# Altium project StandaloneDevice.PrjPcb
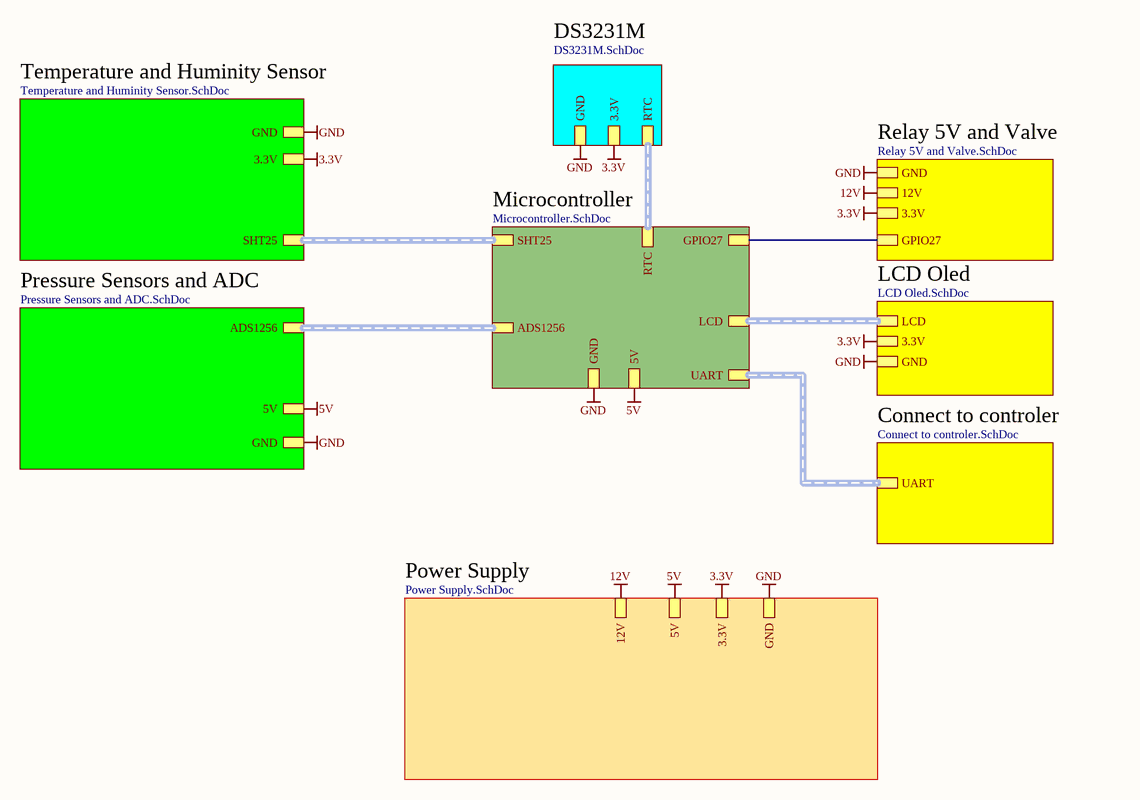
[diagram p0: StandaloneDevice.SchDoc]
9 sheets, 13 parts. Net scope: hierarchical (ports join the sheet entries above them; power ports are global).
Board file: StandaloneDevice.PcbDoc
Sheets:
  StandaloneDevice.SchDoc
    Pressure Sensors and ADC = Pressure Sensors and ADC.SchDoc
    Temperature and Huminity Sensor = Temperature and Huminity Sensor.SchDoc
    Microcontroller = Microcontroller.SchDoc
    Power Supply = Power Supply.SchDoc
    Relay 5V and Valve = Relay 5V and Valve.SchDoc
    LCD Oled = LCD Oled.SchDoc
    DS3231M = DS3231M.SchDoc
    Connect to controler = Connect to controler.SchDoc

## Sheet StandaloneDevice.SchDoc
size A4; SheetNumber: 1; SheetTotal: 9

### Sub-sheets
Connect to controler = Connect to controler.SchDoc: UART (harness UART)
DS3231M = DS3231M.SchDoc: RTC (harness RTC), 3.3V, GND
LCD Oled = LCD Oled.SchDoc: LCD (harness LCD), 3.3V, GND
Microcontroller = Microcontroller.SchDoc: GPIO27, ADS1256 (harness ADS1256), SHT25 (harness SHT25), LCD (harness LCD), RTC (harness RTC), UART (harness UART), GND, 5V
Power Supply = Power Supply.SchDoc: 12V, 5V, 3.3V, GND
Pressure Sensors and ADC = Pressure Sensors and ADC.SchDoc: ADS1256 (harness ADS1256), 5V, GND
Relay 5V and Valve = Relay 5V and Valve.SchDoc: GPIO27, GND, 12V, 3.3V
Temperature and Huminity Sensor = Temperature and Huminity Sensor.SchDoc: SHT25 (harness SHT25), GND, 3.3V

### Nets
3.3V: sheet Temperature and Huminity Sensor/3.3V, sheet Power Supply/3.3V, sheet Relay 5V and Valve/3.3V, sheet LCD Oled/3.3V, sheet DS3231M/3.3V
5V: sheet Pressure Sensors and ADC/5V, sheet Microcontroller/5V, sheet Power Supply/5V
12V: sheet Power Supply/12V, sheet Relay 5V and Valve/12V
GND: sheet Pressure Sensors and ADC/GND, sheet Temperature and Huminity Sensor/GND, sheet Microcontroller/GND, sheet Power Supply/GND, sheet Relay 5V and Valve/GND, sheet LCD Oled/GND, sheet DS3231M/GND
GPIO27: sheet Microcontroller/GPIO27, sheet Relay 5V and Valve/GPIO27

### Buses and harness runs
harness sheet Connect to controler/UART = sheet Microcontroller/UART
harness sheet DS3231M/RTC = sheet Microcontroller/RTC
harness sheet LCD Oled/LCD = sheet Microcontroller/LCD
harness sheet Microcontroller/ADS1256 = sheet Pressure Sensors and ADC/ADS1256
harness sheet Microcontroller/SHT25 = sheet Temperature and Huminity Sensor/SHT25

## Sheet Pressure Sensors and ADC.SchDoc
size A4; SheetNumber: 2; SheetTotal: 9
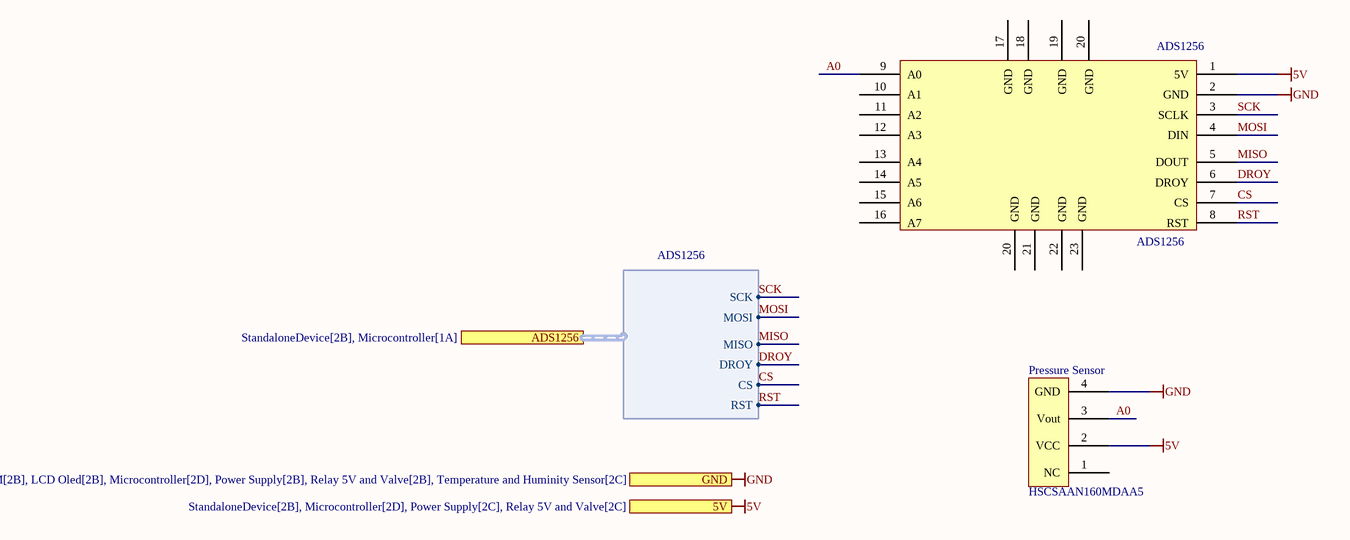
[diagram p1: Pressure Sensors and ADC.SchDoc]

### Parts
ADS1256  ADS1256  [ADS1256]
Pressure_Sensor  HSCSAAN160MDAA5  [HSCSAAN160MDAA5]

### Ports
5V (see StandaloneDevice[2B], Microcontroller[2D], Power Supply[2C], Relay 5V and Valve[2C]), ADS1256 (harness ADS1256, see StandaloneDevice[2B], Microcontroller[1A]), GND (see StandaloneDevice[2C], DS3231M[2B], LCD Oled[2B], Microcontroller[2D], Power Supply[2B], Relay 5V and Valve[2B], Temperature and Huminity Sensor[2C])

### Harnesses
ADS1256: SCK, MOSI, MISO, DROY, CS, RST

### Nets
5V: ADS1256.1(5V) Pressure_Sensor.2(VCC) ; port 5V
GND: ADS1256.2(GND) Pressure_Sensor.4(GND) ; port GND
A0: ADS1256.9(A0) Pressure_Sensor.3(Vout)
CS: ADS1256.7(CS) ; port ADS1256.CS
DROY: ADS1256.6(DROY) ; port ADS1256.DROY
MISO: ADS1256.5(DOUT) ; port ADS1256.MISO
MOSI: ADS1256.4(DIN) ; port ADS1256.MOSI
RST: ADS1256.8(RST) ; port ADS1256.RST
SCK: ADS1256.3(SCLK) ; port ADS1256.SCK

Not connected (* = marked no-connect by the designer): ADS1256 10(A1) 11(A2) 12(A3) 13(A4) 14(A5) 15(A6) 16(A7) 17(GND) 18(GND) 19(GND) 20(GND) 21(GND) 22(GND) 23(GND); Pressure_Sensor 1(NC)

## Sheet Temperature and Huminity Sensor.SchDoc
size A4; SheetNumber: 3; SheetTotal: 9
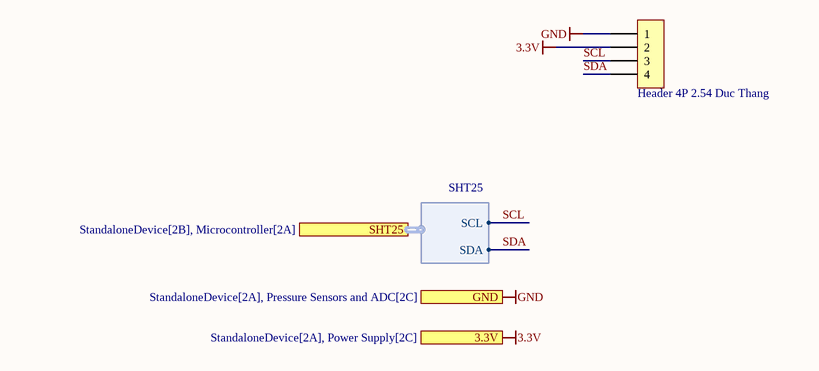
[diagram p2: Temperature and Huminity Sensor.SchDoc]

### Parts
SHT25  Header 4P 2.54 Duc Thang  [XH2.54M-4]

### Ports
3.3V (see StandaloneDevice[2A], Power Supply[2C]), GND (see StandaloneDevice[2A], Pressure Sensors and ADC[2C]), SHT25 (harness SHT25, see StandaloneDevice[2B], Microcontroller[2A])

### Harnesses
SHT25: SCL, SDA

### Nets
3.3V: SHT25.2 ; port 3.3V
GND: SHT25.1 ; port GND
SCL: SHT25.3 ; port SHT25.SCL
SDA: SHT25.4 ; port SHT25.SDA

### Library data of the parts
SHT25 = Header 4P 2.54 Duc Thang: Cắm; Ten_Linh_Kien: Header 4P XH2.54-4P Đực Thẳng; Don_Vi: Con; Ma_Hang: MH001285; Chung_Loai: Cắm

## Sheet Microcontroller.SchDoc
size A4; SheetNumber: 4; SheetTotal: 9
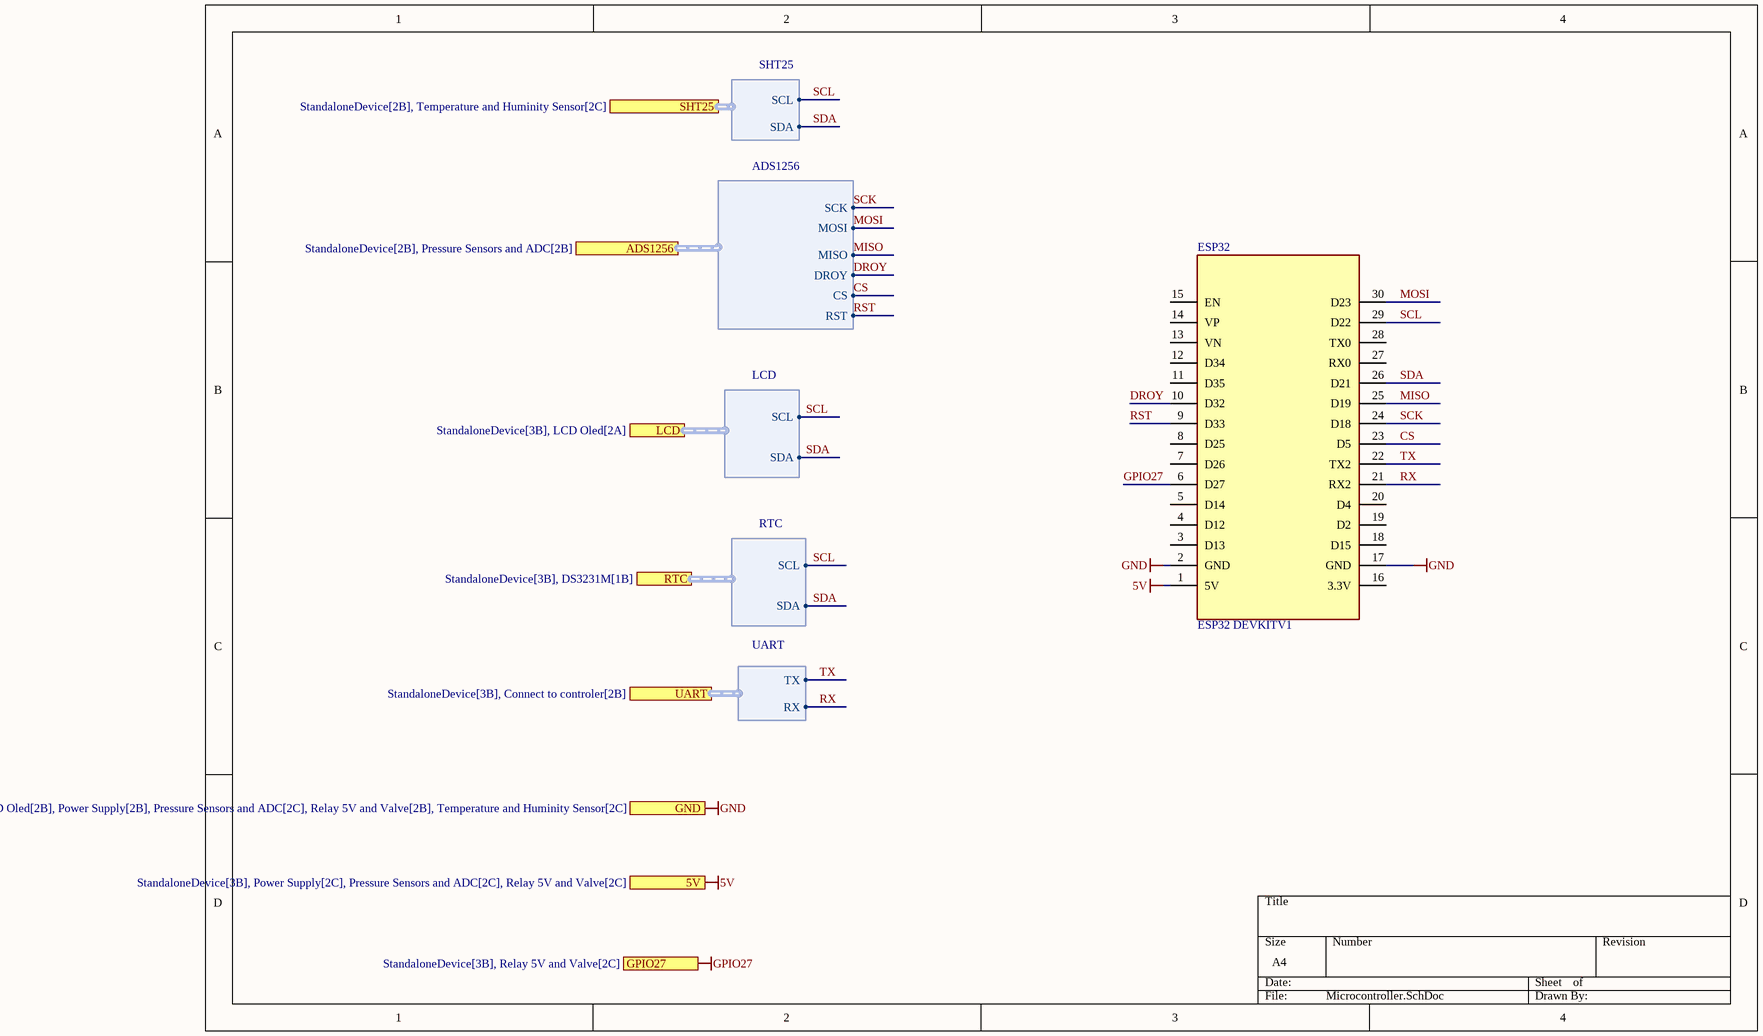
[diagram p3: Microcontroller.SchDoc]

### Parts
ESP32  ESP32 DEVKITV1  [ESP32 DEVKITV1]

### Ports
5V (see StandaloneDevice[3B], Power Supply[2C], Pressure Sensors and ADC[2C], Relay 5V and Valve[2C]), ADS1256 (harness ADS1256, see StandaloneDevice[2B], Pressure Sensors and ADC[2B]), GND (see StandaloneDevice[3B], DS3231M[2B], LCD Oled[2B], Power Supply[2B], Pressure Sensors and ADC[2C], Relay 5V and Valve[2B], Temperature and Huminity Sensor[2C]), GPIO27 (see StandaloneDevice[3B], Relay 5V and Valve[2C]), LCD (harness LCD, see StandaloneDevice[3B], LCD Oled[2A]), RTC (harness RTC, see StandaloneDevice[3B], DS3231M[1B]), SHT25 (harness SHT25, see StandaloneDevice[2B], Temperature and Huminity Sensor[2C]), UART (harness UART, see StandaloneDevice[3B], Connect to controler[2B])

### Harnesses
SHT25: SCL, SDA
ADS1256: SCK, MOSI, MISO, DROY, CS, RST
LCD: SCL, SDA
RTC: SCL, SDA
UART: TX, RX

### Nets
5V: ESP32.1(5V) ; port 5V
GND: ESP32.2(GND) ESP32.17(GND) ; port GND
GPIO27: ESP32.6(D27) ; port GPIO27
CS: ESP32.23(D5) ; port ADS1256.CS
DROY: ESP32.10(D32) ; port ADS1256.DROY
MISO: ESP32.25(D19) ; port ADS1256.MISO
MOSI: ESP32.30(D23) ; port ADS1256.MOSI
RST: ESP32.9(D33) ; port ADS1256.RST
RX: ESP32.21(RX2) ; port UART.RX
SCK: ESP32.24(D18) ; port ADS1256.SCK
SCL: ESP32.29(D22) ; port SHT25.SCL, port LCD.SCL, port RTC.SCL
SDA: ESP32.26(D21) ; port SHT25.SDA, port LCD.SDA, port RTC.SDA
TX: ESP32.22(TX2) ; port UART.TX

Not connected (* = marked no-connect by the designer): ESP32 3(D13) 4(D12) 5(D14) 7(D26) 8(D25) 11(D35) 12(D34) 13(VN) 14(VP) 15(EN) 16(3.3V) 18(D15) 19(D2) 20(D4) 27(RX0) 28(TX0)

### Library data of the parts
ESP32 = ESP32 DEVKITV1: MF: Espressif Systems; MP: ESP32 NODEMCU; SnapEDA_Link: https://www.snapeda.com/parts/ESP32%20NODEMCU/Espressif+Systems/view-part/?ref=snap; Package: Package; Value: *; Check_prices: https://www.snapeda.com/parts/ESP32%20NODEMCU/Espressif+Systems/view-part/?ref=eda

## Sheet Power Supply.SchDoc
size A4; SheetNumber: 7; SheetTotal: 9
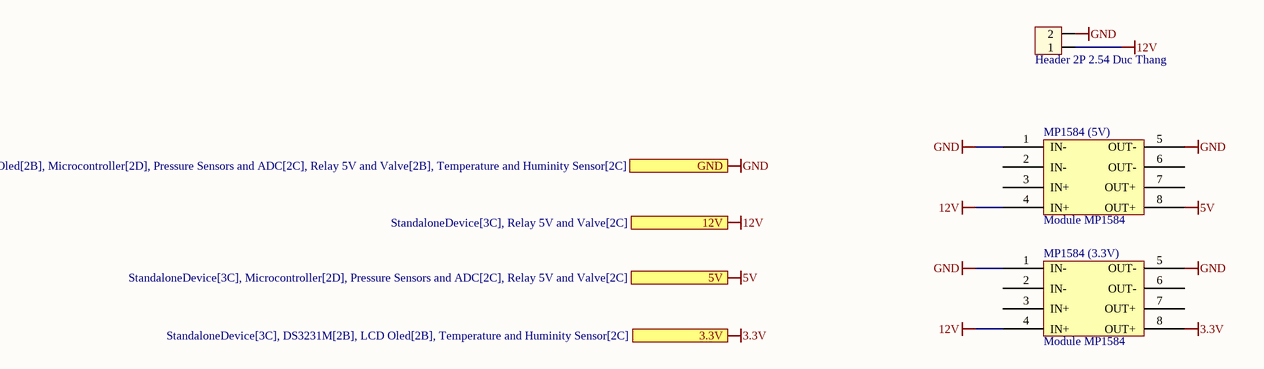
[diagram p4: Power Supply.SchDoc]

### Parts
MP1584_(3.3V)  Module MP1584  [module mP1584]
MP1584_(5V)  Module MP1584  [module mP1584]
POW  Header 2P 2.54 Duc Thang  [XH2.54M-2]

### Ports
3.3V (see StandaloneDevice[3C], DS3231M[2B], LCD Oled[2B], Temperature and Huminity Sensor[2C]), 5V (see StandaloneDevice[3C], Microcontroller[2D], Pressure Sensors and ADC[2C], Relay 5V and Valve[2C]), 12V (see StandaloneDevice[3C], Relay 5V and Valve[2C]), GND (see StandaloneDevice[3C], DS3231M[2B], LCD Oled[2B], Microcontroller[2D], Pressure Sensors and ADC[2C], Relay 5V and Valve[2B], Temperature and Huminity Sensor[2C])

### Nets
3.3V: MP1584_(3.3V).8(OUT+) ; port 3.3V
5V: MP1584_(5V).8(OUT+) ; port 5V
12V: MP1584_(3.3V).4(IN+) MP1584_(5V).4(IN+) POW.1 ; port 12V
GND: MP1584_(3.3V).1(IN-) MP1584_(3.3V).5(OUT-) MP1584_(5V).1(IN-) MP1584_(5V).5(OUT-) POW.2 ; port GND

Not connected (* = marked no-connect by the designer): MP1584_(3.3V) 2(IN-) 3(IN+) 6(OUT-) 7(OUT+); MP1584_(5V) 2(IN-) 3(IN+) 6(OUT-) 7(OUT+)

### Library data of the parts
MP1584_(3.3V) MP1584_(5V) = Module MP1584: MF: Espressif Systems; MP: ESP32 NODEMCU; SnapEDA_Link: https://www.snapeda.com/parts/ESP32%20NODEMCU/Espressif+Systems/view-part/?ref=snap; Package: Package; Value: *; Check_prices: https://www.snapeda.com/parts/ESP32%20NODEMCU/Espressif+Systems/view-part/?ref=eda
POW = Header 2P 2.54 Duc Thang: Cắm; Ten_Linh_Kien: Header 2P XH2.54-2P Đực Thẳng; Don_Vi: Con; Ma_Hang: MH001283; Chung_Loai: Cắm

## Sheet Relay 5V and Valve.SchDoc
size A4; SheetNumber: 5; SheetTotal: 9
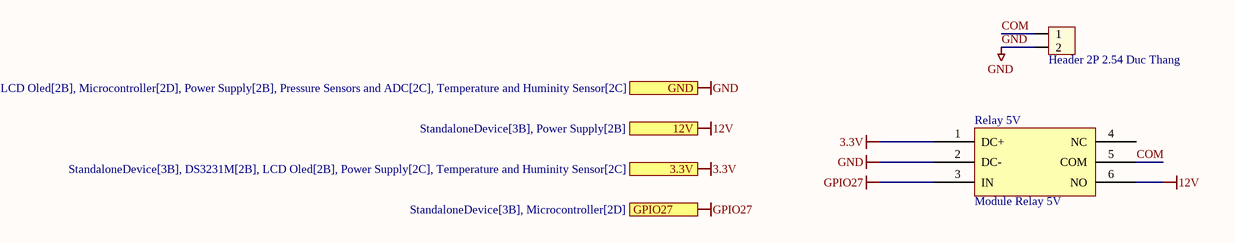
[diagram p5: Relay 5V and Valve.SchDoc]

### Parts
(Parts that share a designator on the sheet are numbered #1, #2 ... from top to bottom, then left to right.)
Relay_5V  Module Relay 5V  [Module Relay 5V]
Van#1  Header 2P 2.54 Duc Thang  [XH2.54M-2]

### Ports
3.3V (see StandaloneDevice[3B], DS3231M[2B], LCD Oled[2B], Power Supply[2C], Temperature and Huminity Sensor[2C]), 12V (see StandaloneDevice[3B], Power Supply[2B]), GND (see StandaloneDevice[3A], DS3231M[2B], LCD Oled[2B], Microcontroller[2D], Power Supply[2B], Pressure Sensors and ADC[2C], Temperature and Huminity Sensor[2C]), GPIO27 (see StandaloneDevice[3B], Microcontroller[2D])

### Nets
3.3V: Relay_5V.1(DC+) ; port 3.3V
12V: Relay_5V.6(NO) ; port 12V
GND: Relay_5V.2(DC-) Van#1.2 ; port GND
GPIO27: Relay_5V.3(IN) ; port GPIO27
COM: Relay_5V.5(COM) Van#1.1

Not connected (* = marked no-connect by the designer): Relay_5V 4(NC)

### Library data of the parts
Van#1 = Header 2P 2.54 Duc Thang: as POW on sheet Power Supply; Chung_Loai: Cắm

## Sheet LCD Oled.SchDoc
size A4; SheetNumber: 6; SheetTotal: 9
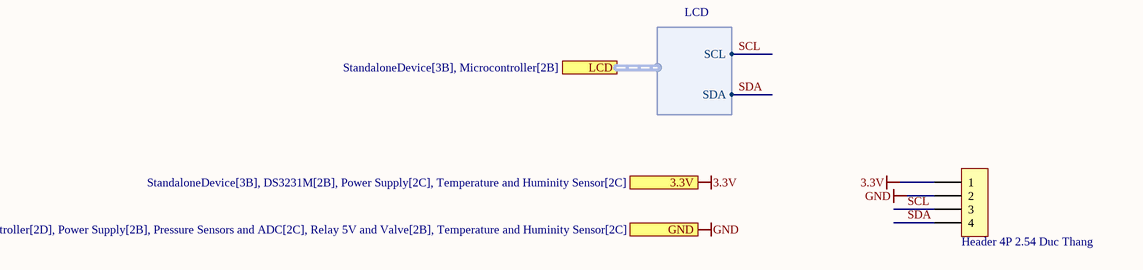
[diagram p6: LCD Oled.SchDoc]

### Parts
LCD  Header 4P 2.54 Duc Thang  [XH2.54M-4]

### Ports
3.3V (see StandaloneDevice[3B], DS3231M[2B], Power Supply[2C], Temperature and Huminity Sensor[2C]), GND (see StandaloneDevice[3B], DS3231M[2B], Microcontroller[2D], Power Supply[2B], Pressure Sensors and ADC[2C], Relay 5V and Valve[2B], Temperature and Huminity Sensor[2C]), LCD (harness LCD, see StandaloneDevice[3B], Microcontroller[2B])

### Harnesses
LCD: SCL, SDA

### Nets
3.3V: LCD.1 ; port 3.3V
GND: LCD.2 ; port GND
SCL: LCD.3 ; port LCD.SCL
SDA: LCD.4 ; port LCD.SDA

### Library data of the parts
LCD = Header 4P 2.54 Duc Thang: as SHT25 on sheet Temperature and Huminity Sensor; Chung_Loai: Cắm

## Sheet DS3231M.SchDoc
size A4; SheetNumber: 8; SheetTotal: 9
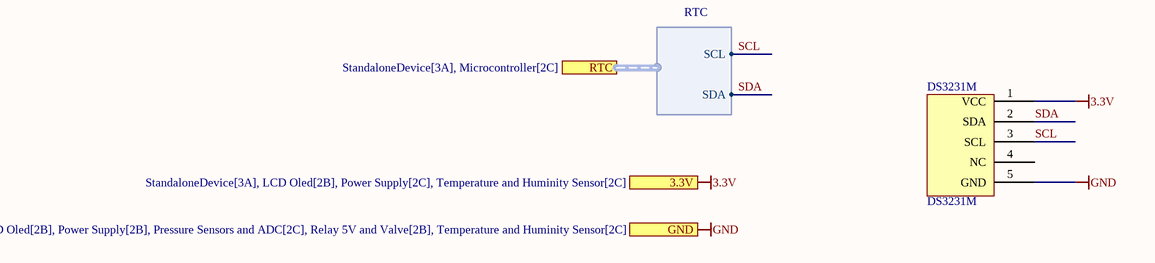
[diagram p7: DS3231M.SchDoc]

### Parts
DS3231M  DS3231M  [Module DS3231M]

### Ports
3.3V (see StandaloneDevice[3A], LCD Oled[2B], Power Supply[2C], Temperature and Huminity Sensor[2C]), GND (see StandaloneDevice[3A], LCD Oled[2B], Power Supply[2B], Pressure Sensors and ADC[2C], Relay 5V and Valve[2B], Temperature and Huminity Sensor[2C]), RTC (harness RTC, see StandaloneDevice[3A], Microcontroller[2C])

### Harnesses
RTC: SCL, SDA

### Nets
3.3V: DS3231M.1(VCC) ; port 3.3V
GND: DS3231M.5(GND) ; port GND
SCL: DS3231M.3(SCL) ; port RTC.SCL
SDA: DS3231M.2(SDA) ; port RTC.SDA

Not connected (* = marked no-connect by the designer): DS3231M 4(NC)

## Sheet Connect to controler.SchDoc
size A4; SheetNumber: 9; SheetTotal: 9
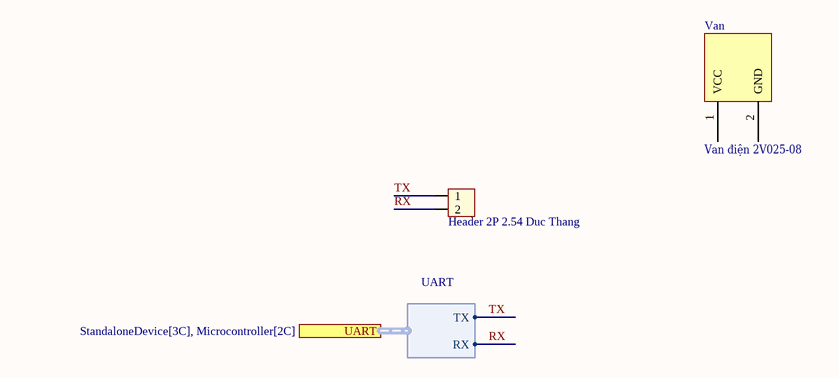
[diagram p8: Connect to controler.SchDoc]

### Parts
(Parts that share a designator on the sheet are numbered #1, #2 ... from top to bottom, then left to right.)
UART  Header 2P 2.54 Duc Thang  [XH2.54M-2]
Van#2  Van điện 2V025-08  [Van 2V025-08]

### Ports
UART (harness UART, see StandaloneDevice[3C], Microcontroller[2C])

### Harnesses
UART: TX, RX

### Nets
RX: UART.2 ; port UART.RX
TX: UART.1 ; port UART.TX

Not connected (* = marked no-connect by the designer): Van#2 1(VCC) 2(GND)

### Library data of the parts
UART = Header 2P 2.54 Duc Thang: as POW on sheet Power Supply; Chung_Loai: Cắm

## Nets that join several sheets
3.3V: Temperature and Huminity Sensor (SHT25.2), Power Supply (MP1584_(3.3V).8), Relay 5V and Valve (Relay_5V.1), LCD Oled (LCD.1), DS3231M (DS3231M.1)
5V: Pressure Sensors and ADC (ADS1256.1 Pressure_Sensor.2), Microcontroller (ESP32.1), Power Supply (MP1584_(5V).8)
12V: Power Supply (MP1584_(3.3V).4 MP1584_(5V).4 POW.1), Relay 5V and Valve (Relay_5V.6)
GND: Pressure Sensors and ADC (ADS1256.2 Pressure_Sensor.4), Temperature and Huminity Sensor (SHT25.1), Microcontroller (ESP32.2 ESP32.17), Power Supply (5 pins), Relay 5V and Valve (Relay_5V.2 Van#1.2), LCD Oled (LCD.2), DS3231M (DS3231M.5)
GPIO27: Microcontroller (ESP32.6), Relay 5V and Valve (Relay_5V.3)
CS: Pressure Sensors and ADC (ADS1256.7), Microcontroller (ESP32.23)
DROY: Pressure Sensors and ADC (ADS1256.6), Microcontroller (ESP32.10)
MISO: Pressure Sensors and ADC (ADS1256.5), Microcontroller (ESP32.25)
MOSI: Pressure Sensors and ADC (ADS1256.4), Microcontroller (ESP32.30)
RST: Pressure Sensors and ADC (ADS1256.8), Microcontroller (ESP32.9)
RX: Microcontroller (ESP32.21), Connect to controler (UART.2)
SCK: Pressure Sensors and ADC (ADS1256.3), Microcontroller (ESP32.24)
SCL: Temperature and Huminity Sensor (SHT25.3), Microcontroller (ESP32.29), LCD Oled (LCD.3), DS3231M (DS3231M.3)
SDA: Temperature and Huminity Sensor (SHT25.4), Microcontroller (ESP32.26), LCD Oled (LCD.4), DS3231M (DS3231M.2)
TX: Microcontroller (ESP32.22), Connect to controler (UART.1)